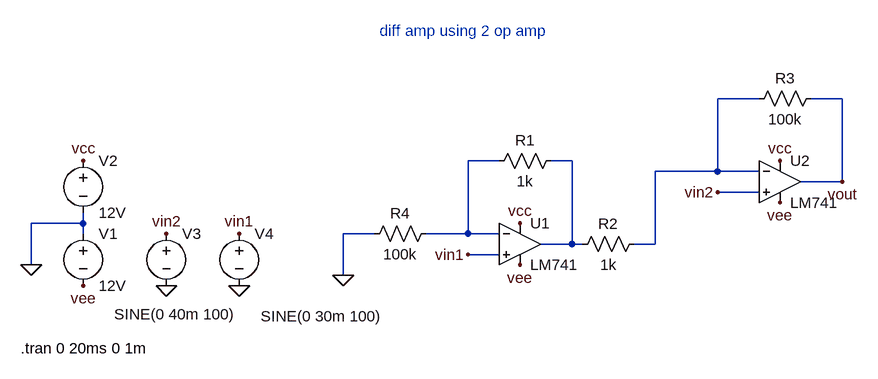
[diagram p0: schematic diff_amp_using_two_op_amp.asc]
diff_amp_using_two_op_amp.asc, the LTspice schematic file:
Version 4.1
SHEET 1 892 680
WIRE 720 -16 656 -16
WIRE 848 -16 800 -16
WIRE 320 80 272 80
WIRE 432 80 400 80
WIRE 656 96 656 -16
WIRE 656 96 560 96
WIRE 720 96 656 96
WIRE 848 112 848 -16
WIRE 848 112 784 112
WIRE 720 128 656 128
WIRE -320 176 -320 160
WIRE -320 176 -400 176
WIRE -320 192 -320 176
WIRE 128 192 80 192
WIRE 272 192 272 80
WIRE 272 192 208 192
WIRE 320 192 272 192
WIRE 432 208 432 80
WIRE 432 208 384 208
WIRE 448 208 432 208
WIRE 560 208 560 96
WIRE 560 208 528 208
WIRE 320 224 272 224
WIRE -400 240 -400 176
WIRE 80 256 80 192
FLAG -80 272 0
FLAG -192 272 0
FLAG -400 240 0
FLAG 352 176 vcc
FLAG 752 80 vcc
FLAG -320 80 vcc
FLAG 352 240 vee
FLAG 752 144 vee
FLAG -320 272 vee
FLAG -80 192 vin1
FLAG -192 192 vin2
FLAG 272 224 vin1
FLAG 656 128 vin2
FLAG 80 256 0
FLAG 848 112 vout
SYMBOL LM741 352 144 R0
SYMATTR InstName U1
SYMBOL LM741 752 48 R0
SYMATTR InstName U2
SYMBOL voltage -320 176 R0
WINDOW 123 0 0 Left 0
WINDOW 39 0 0 Left 0
SYMATTR InstName V1
SYMATTR Value 12V
SYMBOL voltage -320 64 R0
WINDOW 123 0 0 Left 0
WINDOW 39 0 0 Left 0
SYMATTR InstName V2
SYMATTR Value 12V
SYMBOL voltage -192 176 R0
WINDOW 3 -80 140 Left 2
WINDOW 123 0 0 Left 0
WINDOW 39 0 0 Left 0
SYMATTR InstName V3
SYMATTR Value SINE(0 40m 100)
SYMBOL voltage -80 176 R0
WINDOW 3 33 143 Left 2
WINDOW 123 0 0 Left 0
WINDOW 39 0 0 Left 0
SYMATTR InstName V4
SYMATTR Value SINE(0 30m 100)
SYMBOL res 416 64 R90
WINDOW 0 0 56 VBottom 2
WINDOW 3 32 56 VTop 2
SYMATTR InstName R1
SYMATTR Value 1k
SYMBOL res 544 192 R90
WINDOW 0 0 56 VBottom 2
WINDOW 3 32 56 VTop 2
SYMATTR InstName R2
SYMATTR Value 1k
SYMBOL res 816 -32 R90
WINDOW 0 0 56 VBottom 2
WINDOW 3 32 56 VTop 2
SYMATTR InstName R3
SYMATTR Value 100k
SYMBOL res 224 176 R90
WINDOW 0 0 56 VBottom 2
WINDOW 3 32 56 VTop 2
SYMATTR InstName R4
SYMATTR Value 100k
TEXT 136 -120 Left 2 ;diff amp using 2 op amp
TEXT -416 368 Left 2 !.tran 0 20ms 0 1m

The netlist it stands for:
* diff_amp_using_two_op_amp.asc
X§U1 vin1 N002 vcc vee N003 LM741  ; pins In+ In- V+ V- OUT
X§U2 vin2 N001 vcc vee vout LM741  ; pins In+ In- V+ V- OUT
V1 0 vee 12V
V2 vcc 0 12V
V3 vin2 0 SINE(0 40m 100)
V4 vin1 0 SINE(0 30m 100)
R1 N003 N002 1k
R2 N001 N003 1k
R3 vout N001 100k
R4 N002 0 100k
* diff amp using 2 op amp
.tran 0 20ms 0 1m
.lib LM741.lib
.backanno
.end